# EAGLE design breakout (EAGLE 6.5.0)
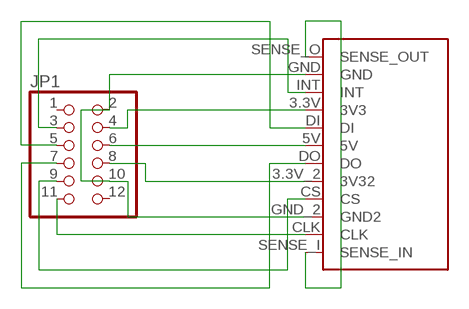
[diagram p0: schematic, sheet 1]

## Parts
JP1  PINHD-2X6  [2X06]
U$1  MEMORY_CARD  [GC_MEMCARD_CON]

## Nets
GND: JP1.2 JP1.10 U$1.GND U$1.GND_2(GND2)
N$1: U$1.SENSE_I(SENSE_IN) U$1.SENSE_O(SENSE_OUT)
N$3: JP1.4 U$1.3.3V(3V3)
N$6: JP1.8 U$1.3.3V_2(3V32)
N$7: JP1.6 U$1.5V
N$8: JP1.11 U$1.CLK
N$9: JP1.9 U$1.CS
N$10: JP1.7 U$1.DO
N$11: JP1.3 U$1.INT
N$12: JP1.5 U$1.DI
Unconnected: JP1.1 JP1.12

## Library data of the parts
JP1 = pinhead:PINHD-2X6: PIN HEADER
U$1 = memory_card:MEMORY_CARD

## Board
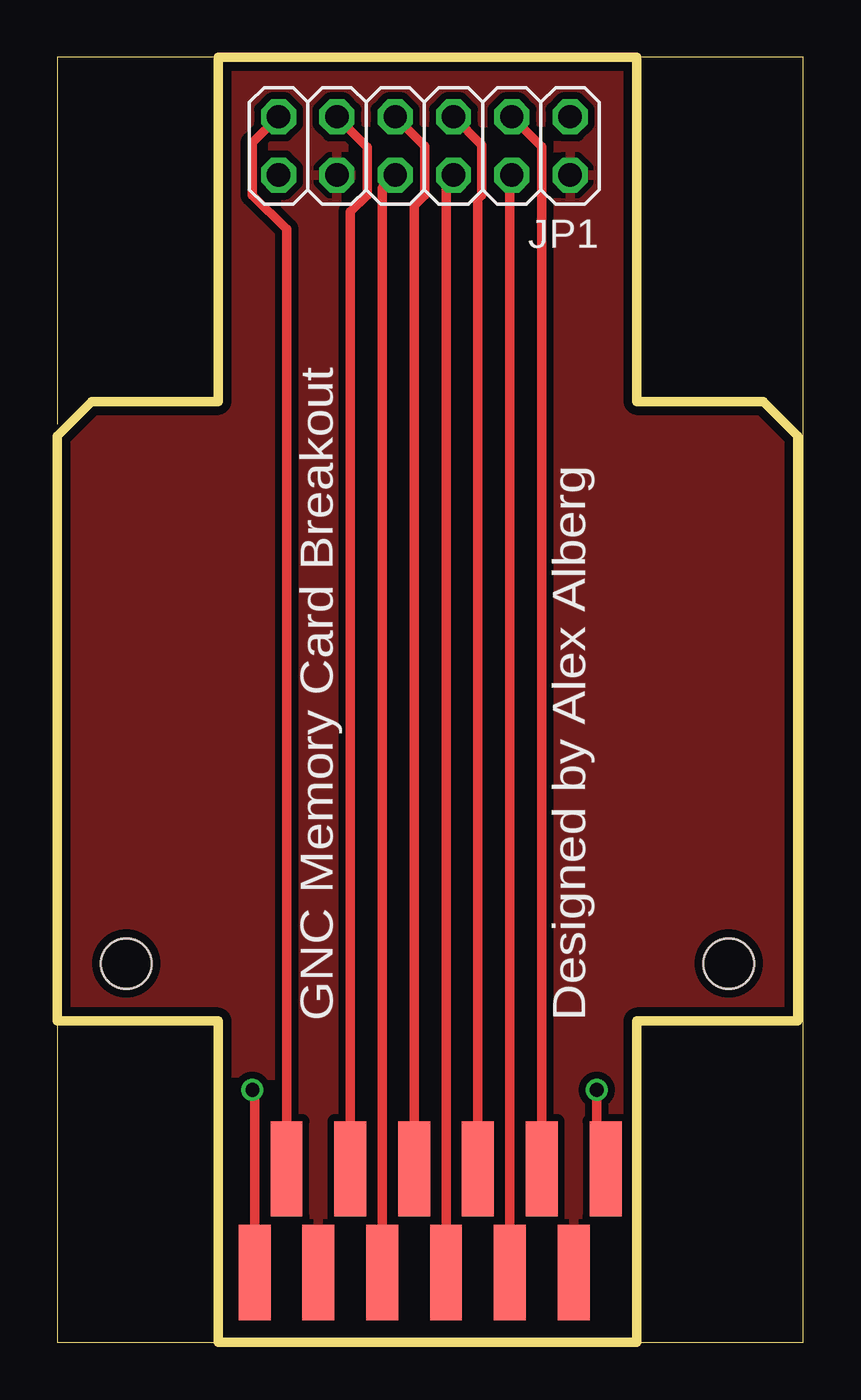
[diagram p1: board, top side]
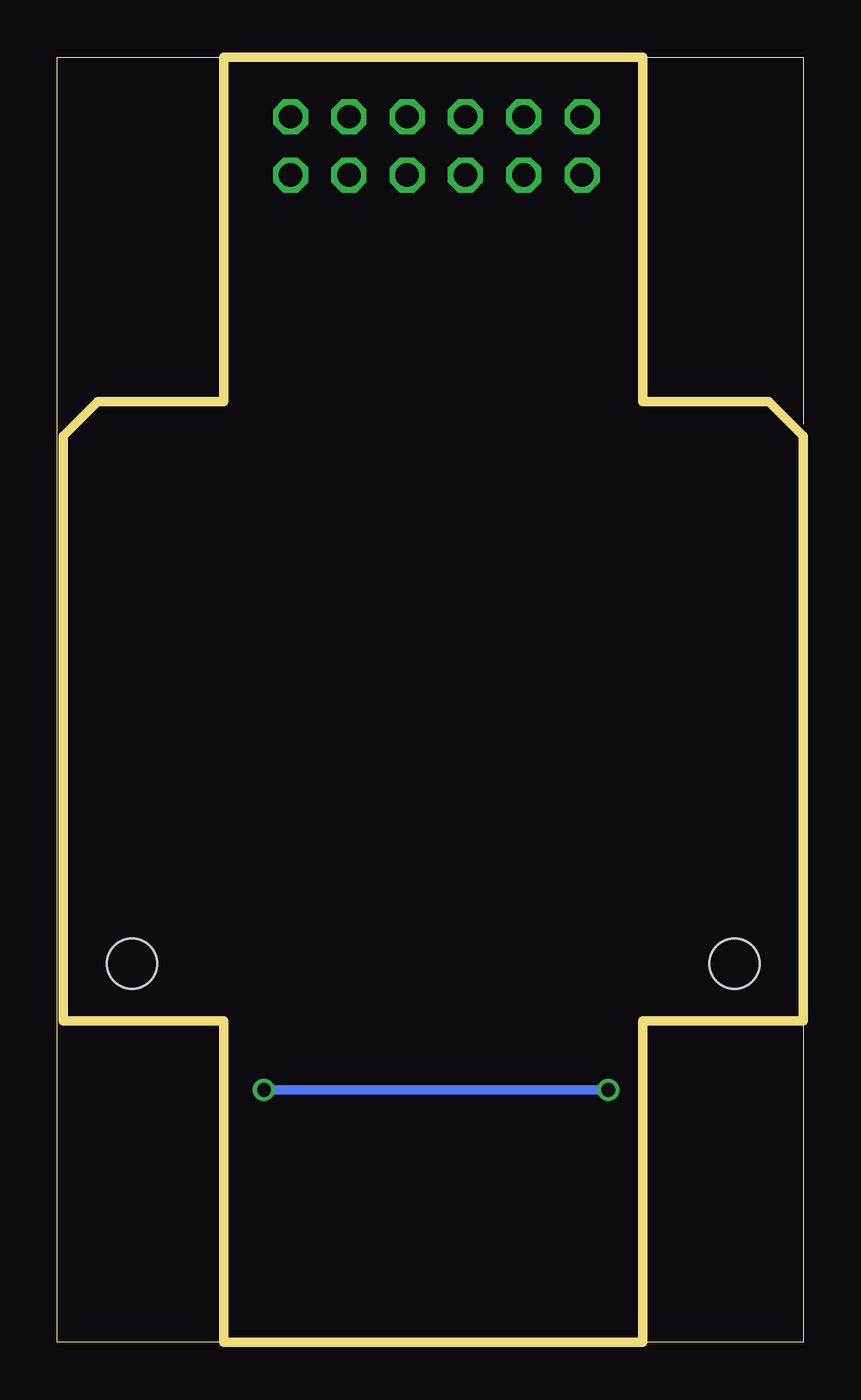
[diagram p2: board, bottom side, seen from below]

Size 32.5 x 56 mm. Coordinates in mm from the lower left corner, seen from the top.
Outline: 7,0 0,0 0,14
Outline: 25.25,0 32.5,0 32.5,56 0,56 0,40.02
Outline: 0,14.2 0,14
Outline: 7,0 7,14 0,14
Outline: 0,14 0,39.5 1.5,41 7,41 7,56 25.25,56 25.25,41 30.75,41 32.25,39.5 32.25,14 25.25,14 25.25,0
Outline: 25.25,0 7,0
Copper layers (1*16): Top 0.0356mm / dielectric 1.5011mm / Bottom 0.0356mm
Design rules "LaenPCBOrder": minimum track width 6mil, minimum drill 13mil, track to track 6mil, track to pad 6mil, pad to pad 6mil, via to via 6mil, smd to smd 6mil, copper to edge 15mil, drill to drill 6mil, minimum pad ring 7mil, minimum via ring 7mil, stop-mask expansion 3mil, vias tented up to drill 0mil, thermal gap 10mil
Holes 2.2 mm at 3,16.5 29.25,16.5

### Footprints (pad centres in the part's own frame; a part is rotated, then mirrored left to right if it is on the bottom)
2X06 = drill 1.016 octagon: 1 -6.35,-1.27; 2 -6.35,1.27; 3 -3.81,-1.27; 4 -3.81,1.27; 5 -1.27,-1.27; 6 -1.27,1.27; 7 1.27,-1.27; 8 1.27,1.27; 9 3.81,-1.27; 10 3.81,1.27; 11 6.35,-1.27; 12 6.35,1.27
GC_MEMCARD_CON = smd 1.39 x 4.15: 3.3V 3.475,-2.085; 3.3V_2 -2.085,-2.085; 5V 0.695,-2.085; CLK -6.255,2.433; CS -3.475,2.433; DI 2.085,2.433; DO -0.695,2.433; GND 6.255,-2.085; GND_2 -4.865,-2.085; INT 4.865,2.433; SENSE_I -7.645,-2.085; SENSE_O 7.645,2.433

### Placement (x,y rotation side)
JP1  15.99,52.14 180 top
U$1  16.24,5.12 0 top

### Tracks (layer width: path | path; a pad name or v marks a point on that pad's centre or on a via)
GND
  pour Top (isolate 0.305): 7,4.5 7,14 0,14 0,39.5 1.5,41 7,41 7,56 25.25,56 25.25,41 30.75,41 32.25,39.5 32.25,14 25.25,14 25.25,4.5
N$1  (via drill 0.6)
  Top 0.406: U$1.SENSE_I 8.6,10.9 v8.5,11 | v23.5,11 23.5,7.94 U$1.SENSE_O
  Bottom 0.406: v8.5,11 v23.5,11
N$3
  Top 0.406: U$1.3.3V 19.71,50.78 JP1.4
N$6
  Top 0.406: U$1.3.3V_2 14.15,50.3 JP1.8
N$7
  Top 0.406: U$1.5V 16.93,50.55 JP1.6
N$8
  Top 0.406: U$1.CLK 9.98,48.52 8.5,50 8.5,52.27 JP1.11
N$9
  Top 0.406: U$1.CS 12.77,49.27 13.5,50 13.5,52.09 JP1.9
N$10
  Top 0.406: U$1.DO 15.54,49.55 16,50 16,52.13 JP1.7
N$11
  Top 0.406: U$1.INT 21.11,52.1 JP1.3
N$12
  Top 0.406: U$1.DI 18.32,49.83 18.5,50 18.5,52.17 JP1.5

### Text on the board
tNames: GNC Memory Card Breakout | Designed by Alex Alberg